# Altium schematic sheet Isolator.SchDoc
size A4; SheetNumber: 3; SheetTotal: 5
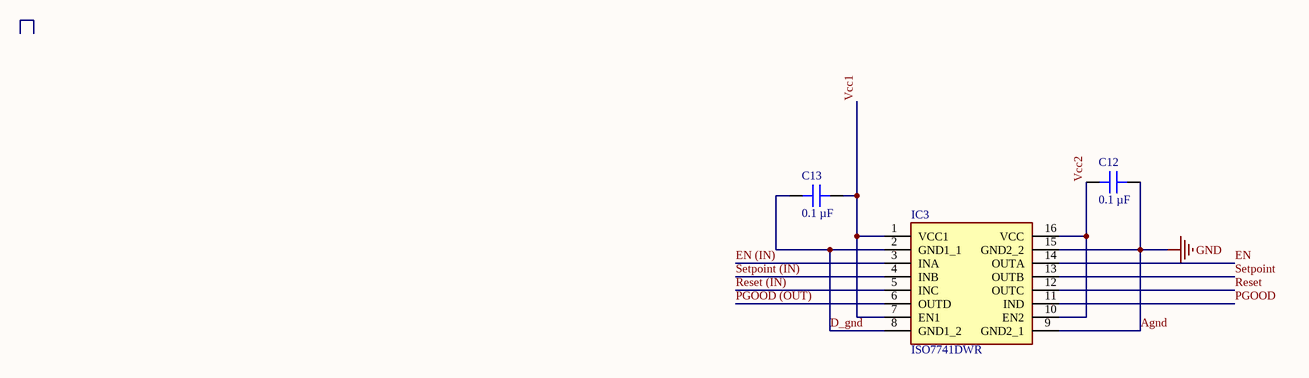
[diagram p0: Isolator.SchDoc]

## Parts
C12  0.1 µF  [CAP 0603_1608]
C13  0.1 µF  [CAP 0603_1608]
IC3  ISO7741DWR  [SOIC127P1030X265-16N]

## Nets
Agnd: C12.2 IC3.9(GND2_1) IC3.15(GND2_2)  [also labelled GND]
D_gnd: C13.1 IC3.2(GND1_1) IC3.8(GND1_2)
EN: IC3.14(OUTA)
EN (IN): IC3.3(INA)
PGOOD: IC3.11(IND)
PGOOD (OUT): IC3.6(OUTD)
Reset: IC3.12(OUTC)
Reset (IN): IC3.5(INC)
Setpoint: IC3.13(OUTB)
Setpoint (IN): IC3.4(INB)
Vcc1: C13.2 IC3.1(VCC1) IC3.7(EN1)
Vcc2: C12.1 IC3.10(EN2) IC3.16(VCC)

## Library data of the parts
C12 C13 = C0603C104K5RAC7411: CAP CER 0.1UF 50V X7R 0603; manufacturer: KEMET; Tolerance: ±10%; Part Number: C0603C104K5RAC7411; Value: 0.1 µF; Applications: Bypass, Decoupling; Capacitance: 0.1 µF; componentlink1description: Datasheet; componentlink1url: https://api.kemet.com/component-edge/download/datasheet/C0603C104K5RAC7411.pdf; componentlink2description: DigiKey Link; componentlink2url: https://www.digikey.com/en/products/detail/kemet/C0603C104K5RAC7411/3317013; Device Package: 0603 (1608 Metric); lastupdated: 15-07-2023 19:07:50; Lifecycle Status: Active; Minimum Order: 1; Mounting Type: Surface Mount, MLCC; Operating Temperature: -55°C ~ 125°C; Package / Case: 0603 (1608 Metric); packaging: TapeAndReel; partid: 2233; Part Status: Active; price: 0.01; series: SMD Comm X7R; Size / Dimension: 0.063" L x 0.031" W (1.60mm x 0.80mm); Supplier 1: DigiKey; Supplier Part Number 1: 399-C0603C104K5RAC7411CT-ND; Temperature Coefficient: X7R; Thickness (Max): 0.035" (0.90mm); Voltage - Rated: 50V
IC3 = ISO7741DWR: Integrated Circuit; Manufacturer_Name: Texas Instruments; Datasheet Link: http://www.ti.com/lit/ds/symlink/iso7741.pdf; Height: 2.65mm; Manufacturer_Part_Number: ISO7741DWR; Mouser Part Number: 595-ISO7741DWR; Mouser Price/Stock: https://www.mouser.co.uk/ProductDetail/Texas-Instruments/ISO7741DWR?qs=dSktwyqbRaVTkqg%252BCYHM7w%3D%3D; Arrow Part Number: ISO7741DWR; Arrow Price/Stock: https://www.arrow.com/en/products/iso7741dwr/texas-instruments?region=nac